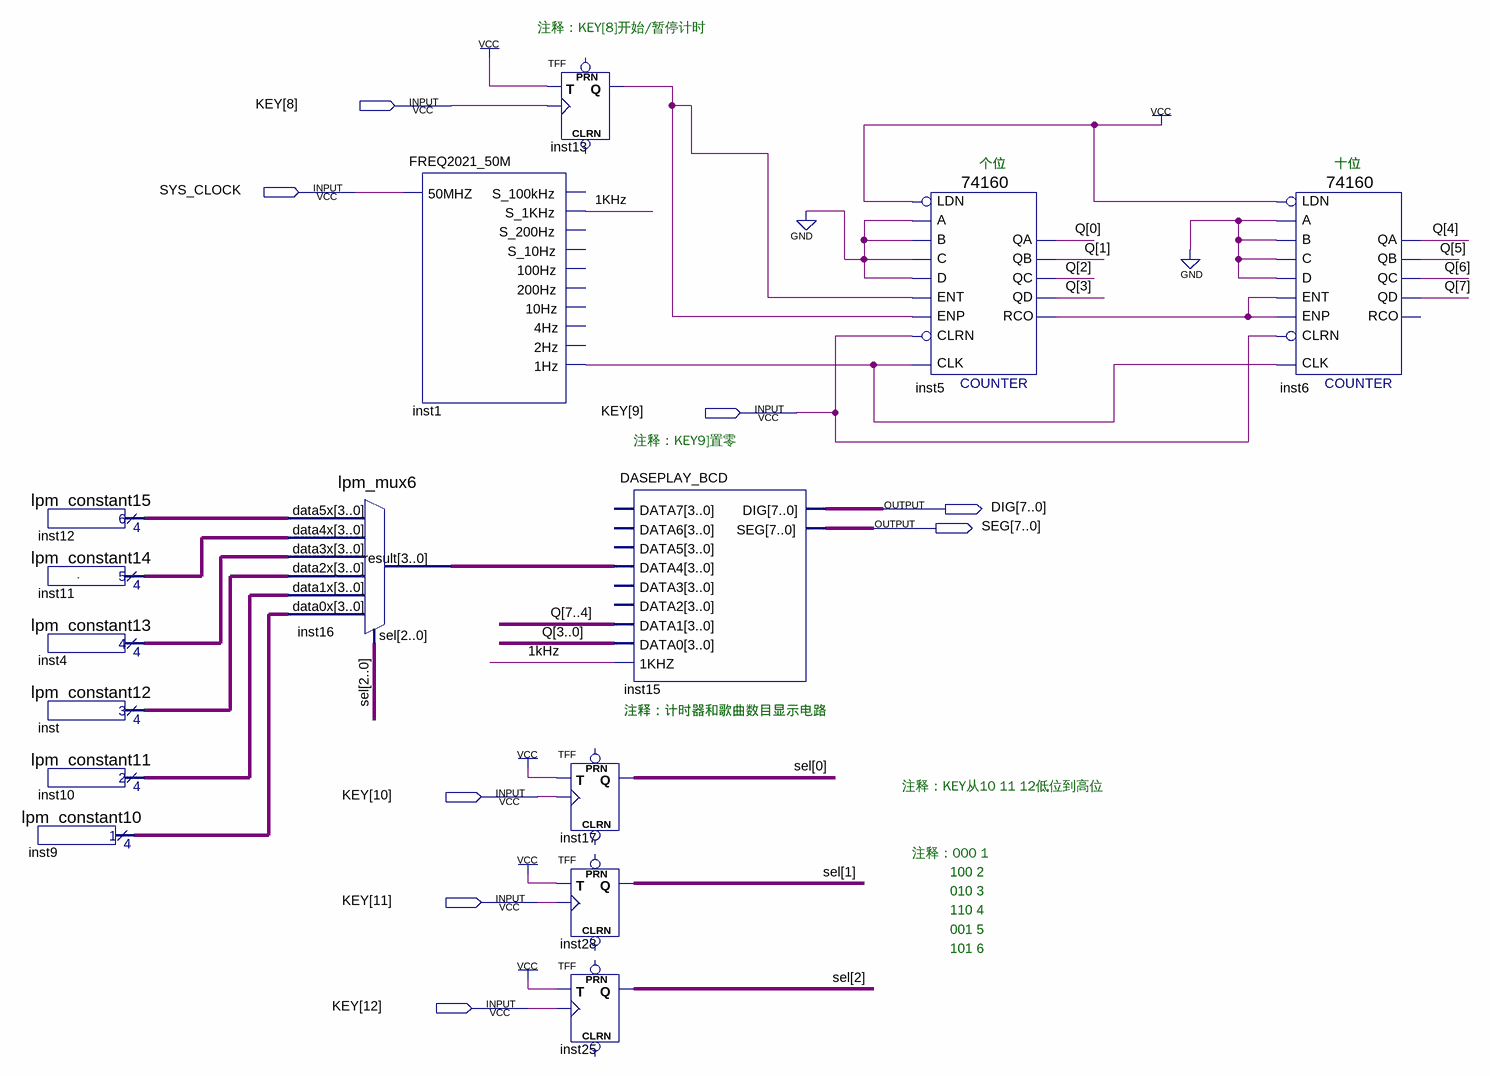
[diagram p0: schematic sheet]
// Quartus schematic LESSON8.bdf as structural Verilog: 15 symbols, 8 pins
module LESSON8 (
  input  [12:8] KEY,
  input  SYS_CLOCK,
  output [7:0] DIG,
  output [7:0] SEG
);

  wire \1kHz , inst1_1hz, inst5_rco, inst13_q;
  wire [2:0] sel;
  wire [3:0] inst4_result, inst9_result, inst10_result, inst11_result, inst12_result, inst16_result,
       inst_result;
  wire [7:0] Q;

  lpm_constant15 inst12 (.result(inst12_result));
  lpm_constant14 inst11 (.result(inst11_result));
  lpm_constant13 inst4 (.result(inst4_result));
  lpm_constant12 inst (.result(inst_result));
  lpm_constant11 inst10 (.result(inst10_result));
  lpm_constant10 inst9 (.result(inst9_result));
  lpm_mux6 inst16 (
    .data5x(inst12_result), .data4x(inst11_result), .data3x(inst4_result), .data2x(inst_result),
    .data1x(inst10_result), .data0x(inst9_result), .sel(sel), .result(inst16_result));
  FREQ2021_50M inst1 (
    .\50MHZ (SYS_CLOCK), .S_1KHz(\1kHz ), .\1Hz (inst1_1hz));  // open: S_100kHz, S_200Hz, S_10Hz, 100Hz, 200Hz, 10Hz, 4Hz, 2Hz
  TFF inst13 (.T(1'b1), .CLK(KEY[8]), .Q(inst13_q));  // open: PRN, CLRN
  DASEPLAY_BCD inst15 (
    .DATA4(inst16_result), .DATA1(Q[7:4]), .DATA0(Q[3:0]), .\1KHZ (\1kHz ), .DIG(DIG), .SEG(SEG));  // open: DATA7, DATA6, DATA5, DATA3, DATA2
  TFF inst17 (.T(1'b1), .CLK(KEY[10]), .Q(sel[0]));  // open: PRN, CLRN
  TFF inst28 (.T(1'b1), .CLK(KEY[11]), .Q(sel[1]));  // open: PRN, CLRN
  TFF inst25 (.T(1'b1), .CLK(KEY[12]), .Q(sel[2]));  // open: PRN, CLRN
  \74160  inst5 (
    .CLK(inst1_1hz), .ENT(inst13_q), .A(1'b0), .B(1'b0), .C(1'b0), .D(1'b0), .LDN(1'b1), .ENP(inst13_q),
    .CLRN(KEY[9]), .QD(Q[3]), .QA(Q[0]), .QB(Q[1]), .QC(Q[2]), .RCO(inst5_rco));
  \74160  inst6 (
    .CLK(inst1_1hz), .ENT(inst5_rco), .A(1'b0), .B(1'b0), .C(1'b0), .D(1'b0), .LDN(1'b1), .ENP(inst5_rco),
    .CLRN(KEY[9]), .QD(Q[7]), .QA(Q[4]), .QB(Q[5]), .QC(Q[6]));  // open: RCO

  // Notes on the sheet:
  //   注释：KEY[8]开始/暂停计时
  //   个位
  //   十位
  //   注释：KEY9]置零
  //   .
  //   注释：计时器和歌曲数目显示电路
  //   注释：KEY从10 11 12低位到高位
  //   注释：000 1
  //   100 2
  //   010 3
  //   110 4
  //   001 5
  //   101 6
endmodule
